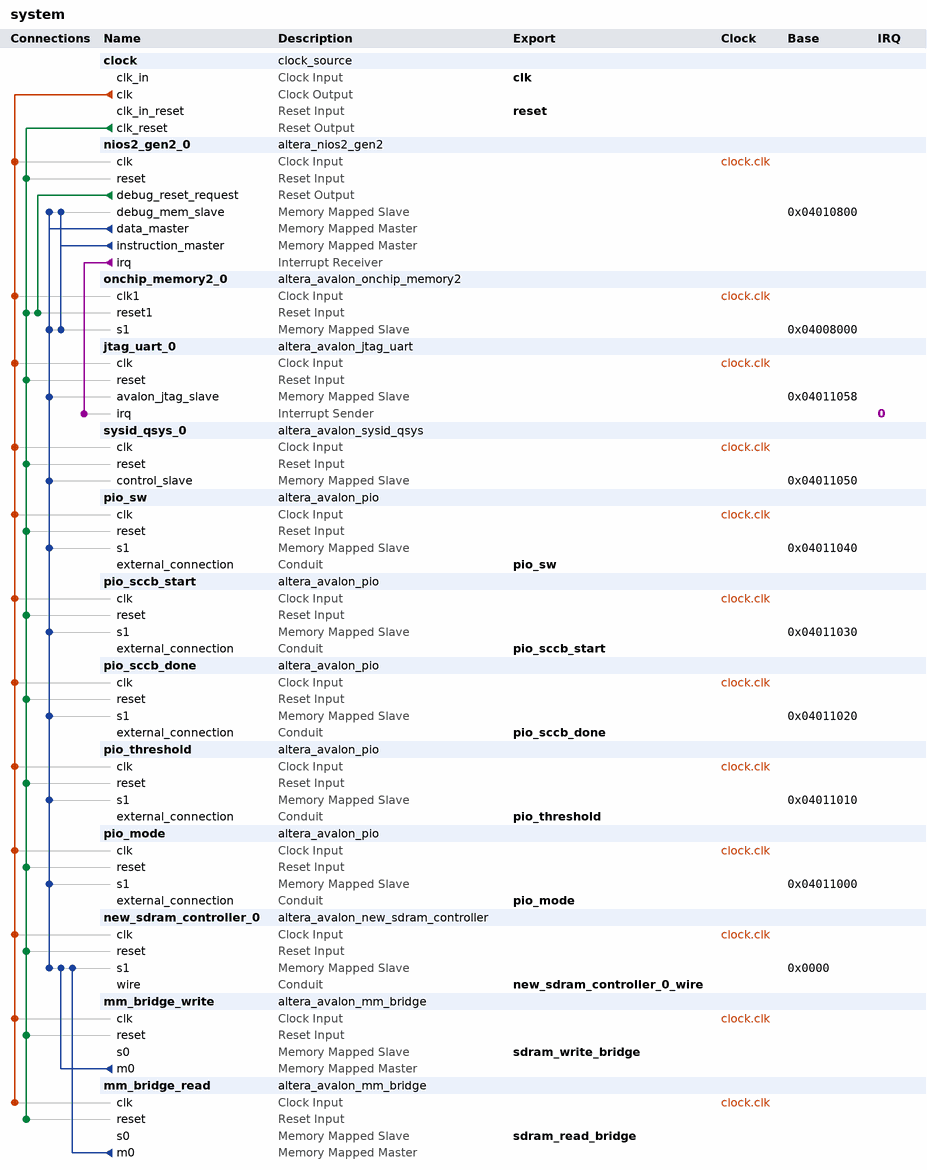
[diagram p0: system contents]
# Platform Designer (Qsys) system system, Cyclone V 5CSEMA5F31C6
# Parameters at their usual value, and those the tool derives, are not listed.
package require -exact qsys 18.1
create_system system
set_project_property DEVICE_FAMILY {Cyclone V}
set_project_property DEVICE 5CSEMA5F31C6

add_instance clock clock_source 18.1
set_instance_parameter_value clock clockFrequency 50000000

add_instance nios2_gen2_0 altera_nios2_gen2 18.1
set_instance_parameter_value nios2_gen2_0 dcache_size 2048
set_instance_parameter_value nios2_gen2_0 exceptionSlave onchip_memory2_0.s1
set_instance_parameter_value nios2_gen2_0 icache_size 4096
set_instance_parameter_value nios2_gen2_0 impl Tiny
set_instance_parameter_value nios2_gen2_0 resetSlave onchip_memory2_0.s1

add_instance onchip_memory2_0 altera_avalon_onchip_memory2 18.1
set_instance_parameter_value onchip_memory2_0 dataWidth 32
set_instance_parameter_value onchip_memory2_0 dualPort false
set_instance_parameter_value onchip_memory2_0 initMemContent true
set_instance_parameter_value onchip_memory2_0 initializationFileName onchip_mem.hex
set_instance_parameter_value onchip_memory2_0 memorySize 32768

add_instance jtag_uart_0 altera_avalon_jtag_uart 18.1
set_instance_parameter_value jtag_uart_0 simInteractiveOptions NO_INTERACTIVE_WINDOWS

add_instance sysid_qsys_0 altera_avalon_sysid_qsys 18.1
set_instance_parameter_value sysid_qsys_0 id 1

add_instance pio_sw altera_avalon_pio 18.1
set_instance_parameter_value pio_sw direction Input
set_instance_parameter_value pio_sw width 10

add_instance pio_sccb_start altera_avalon_pio 18.1
set_instance_parameter_value pio_sccb_start direction Output
set_instance_parameter_value pio_sccb_start width 1

add_instance pio_sccb_done altera_avalon_pio 18.1
set_instance_parameter_value pio_sccb_done direction Input
set_instance_parameter_value pio_sccb_done width 1

add_instance pio_threshold altera_avalon_pio 18.1
set_instance_parameter_value pio_threshold direction Output
set_instance_parameter_value pio_threshold width 8

add_instance pio_mode altera_avalon_pio 18.1
set_instance_parameter_value pio_mode direction Output
set_instance_parameter_value pio_mode width 2

add_instance new_sdram_controller_0 altera_avalon_new_sdram_controller 18.1
set_instance_parameter_value new_sdram_controller_0 TAC 6.0
set_instance_parameter_value new_sdram_controller_0 TRCD 20.0
set_instance_parameter_value new_sdram_controller_0 TRP 20.0
set_instance_parameter_value new_sdram_controller_0 casLatency 3
set_instance_parameter_value new_sdram_controller_0 columnWidth 10
set_instance_parameter_value new_sdram_controller_0 dataWidth 16
set_instance_parameter_value new_sdram_controller_0 generateSimulationModel false
set_instance_parameter_value new_sdram_controller_0 model single_Micron_MT48LC4M32B2_7_chip
set_instance_parameter_value new_sdram_controller_0 numberOfBanks 4
set_instance_parameter_value new_sdram_controller_0 numberOfChipSelects 1
set_instance_parameter_value new_sdram_controller_0 powerUpDelay 100.0
set_instance_parameter_value new_sdram_controller_0 refreshPeriod 15.625
set_instance_parameter_value new_sdram_controller_0 rowWidth 13

add_instance mm_bridge_write altera_avalon_mm_bridge 18.1
set_instance_parameter_value mm_bridge_write ADDRESS_UNITS SYMBOLS
set_instance_parameter_value mm_bridge_write ADDRESS_WIDTH 26
set_instance_parameter_value mm_bridge_write DATA_WIDTH 16
set_instance_parameter_value mm_bridge_write MAX_PENDING_RESPONSES 64
set_instance_parameter_value mm_bridge_write USE_AUTO_ADDRESS_WIDTH 0

add_instance mm_bridge_read altera_avalon_mm_bridge 18.1
set_instance_parameter_value mm_bridge_read ADDRESS_UNITS SYMBOLS
set_instance_parameter_value mm_bridge_read ADDRESS_WIDTH 26
set_instance_parameter_value mm_bridge_read DATA_WIDTH 16
set_instance_parameter_value mm_bridge_read MAX_PENDING_RESPONSES 64
set_instance_parameter_value mm_bridge_read USE_AUTO_ADDRESS_WIDTH 0

# connections
add_connection clock.clk jtag_uart_0.clk clock
add_connection clock.clk mm_bridge_read.clk clock
add_connection clock.clk mm_bridge_write.clk clock
add_connection clock.clk new_sdram_controller_0.clk clock
add_connection clock.clk nios2_gen2_0.clk clock
add_connection clock.clk onchip_memory2_0.clk1 clock
add_connection clock.clk pio_mode.clk clock
add_connection clock.clk pio_sccb_done.clk clock
add_connection clock.clk pio_sccb_start.clk clock
add_connection clock.clk pio_sw.clk clock
add_connection clock.clk pio_threshold.clk clock
add_connection clock.clk sysid_qsys_0.clk clock
add_connection clock.clk_reset jtag_uart_0.reset reset
add_connection clock.clk_reset mm_bridge_read.reset reset
add_connection clock.clk_reset mm_bridge_write.reset reset
add_connection clock.clk_reset new_sdram_controller_0.reset reset
add_connection clock.clk_reset nios2_gen2_0.reset reset
add_connection clock.clk_reset onchip_memory2_0.reset1 reset
add_connection clock.clk_reset pio_mode.reset reset
add_connection clock.clk_reset pio_sccb_done.reset reset
add_connection clock.clk_reset pio_sccb_start.reset reset
add_connection clock.clk_reset pio_sw.reset reset
add_connection clock.clk_reset pio_threshold.reset reset
add_connection clock.clk_reset sysid_qsys_0.reset reset
add_connection nios2_gen2_0.debug_reset_request onchip_memory2_0.reset1 reset
add_connection mm_bridge_read.m0 new_sdram_controller_0.s1 avalon
set_connection_parameter_value mm_bridge_read.m0/new_sdram_controller_0.s1 arbitrationPriority 2
set_connection_parameter_value mm_bridge_read.m0/new_sdram_controller_0.s1 baseAddress 0x0000
add_connection mm_bridge_write.m0 new_sdram_controller_0.s1 avalon
set_connection_parameter_value mm_bridge_write.m0/new_sdram_controller_0.s1 baseAddress 0x0000
add_connection nios2_gen2_0.data_master jtag_uart_0.avalon_jtag_slave avalon
set_connection_parameter_value nios2_gen2_0.data_master/jtag_uart_0.avalon_jtag_slave baseAddress 0x04011058
add_connection nios2_gen2_0.data_master new_sdram_controller_0.s1 avalon
set_connection_parameter_value nios2_gen2_0.data_master/new_sdram_controller_0.s1 baseAddress 0x0000
add_connection nios2_gen2_0.data_master nios2_gen2_0.debug_mem_slave avalon
set_connection_parameter_value nios2_gen2_0.data_master/nios2_gen2_0.debug_mem_slave baseAddress 0x04010800
add_connection nios2_gen2_0.data_master onchip_memory2_0.s1 avalon
set_connection_parameter_value nios2_gen2_0.data_master/onchip_memory2_0.s1 baseAddress 0x04008000
add_connection nios2_gen2_0.data_master pio_mode.s1 avalon
set_connection_parameter_value nios2_gen2_0.data_master/pio_mode.s1 baseAddress 0x04011000
add_connection nios2_gen2_0.data_master pio_sccb_done.s1 avalon
set_connection_parameter_value nios2_gen2_0.data_master/pio_sccb_done.s1 baseAddress 0x04011020
add_connection nios2_gen2_0.data_master pio_sccb_start.s1 avalon
set_connection_parameter_value nios2_gen2_0.data_master/pio_sccb_start.s1 baseAddress 0x04011030
add_connection nios2_gen2_0.data_master pio_sw.s1 avalon
set_connection_parameter_value nios2_gen2_0.data_master/pio_sw.s1 baseAddress 0x04011040
add_connection nios2_gen2_0.data_master pio_threshold.s1 avalon
set_connection_parameter_value nios2_gen2_0.data_master/pio_threshold.s1 baseAddress 0x04011010
add_connection nios2_gen2_0.data_master sysid_qsys_0.control_slave avalon
set_connection_parameter_value nios2_gen2_0.data_master/sysid_qsys_0.control_slave baseAddress 0x04011050
add_connection nios2_gen2_0.instruction_master nios2_gen2_0.debug_mem_slave avalon
set_connection_parameter_value nios2_gen2_0.instruction_master/nios2_gen2_0.debug_mem_slave baseAddress 0x04010800
add_connection nios2_gen2_0.instruction_master onchip_memory2_0.s1 avalon
set_connection_parameter_value nios2_gen2_0.instruction_master/onchip_memory2_0.s1 baseAddress 0x04008000
add_connection nios2_gen2_0.irq jtag_uart_0.irq interrupt
set_connection_parameter_value nios2_gen2_0.irq/jtag_uart_0.irq irqNumber 0

# exported interfaces
add_interface clk clock sink
set_interface_property clk EXPORT_OF clock.clk_in
add_interface new_sdram_controller_0_wire conduit end
set_interface_property new_sdram_controller_0_wire EXPORT_OF new_sdram_controller_0.wire
add_interface pio_mode conduit end
set_interface_property pio_mode EXPORT_OF pio_mode.external_connection
add_interface pio_sccb_done conduit end
set_interface_property pio_sccb_done EXPORT_OF pio_sccb_done.external_connection
add_interface pio_sccb_start conduit end
set_interface_property pio_sccb_start EXPORT_OF pio_sccb_start.external_connection
add_interface pio_sw conduit end
set_interface_property pio_sw EXPORT_OF pio_sw.external_connection
add_interface pio_threshold conduit end
set_interface_property pio_threshold EXPORT_OF pio_threshold.external_connection
add_interface reset reset sink
set_interface_property reset EXPORT_OF clock.clk_in_reset
add_interface sdram_read_bridge avalon slave
set_interface_property sdram_read_bridge EXPORT_OF mm_bridge_read.s0
add_interface sdram_write_bridge avalon slave
set_interface_property sdram_write_bridge EXPORT_OF mm_bridge_write.s0

set_interconnect_requirement {$system} qsys_mm.clockCrossingAdapter HANDSHAKE
set_interconnect_requirement {$system} qsys_mm.enableEccProtection FALSE
set_interconnect_requirement {$system} qsys_mm.insertDefaultSlave FALSE
set_interconnect_requirement {$system} qsys_mm.maxAdditionalLatency 1

save_system system.qsys
